# Altium schematic sheet Top.SchDoc
size B
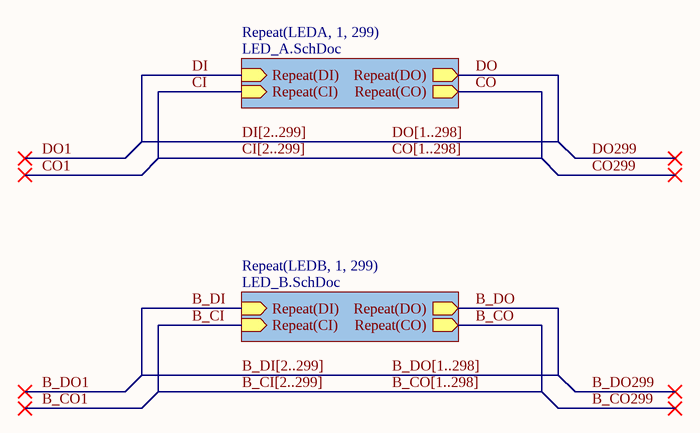
[diagram p0: Top.SchDoc]

## Sub-sheets
Repeat(LEDA, 1, 299) = LED_A.SchDoc: Repeat(DI) (in), Repeat(CI) (in), Repeat(CO) (out), Repeat(DO) (out)
Repeat(LEDB, 1, 299) = LED_B.SchDoc: Repeat(DI) (in), Repeat(CI) (in), Repeat(CO) (out), Repeat(DO) (out)

## Nets
B_CI: sheet Repeat(LEDB, 1, 299)/Repeat(CI)
B_CO: sheet Repeat(LEDB, 1, 299)/Repeat(CO)
B_DI: sheet Repeat(LEDB, 1, 299)/Repeat(DI)
B_DO: sheet Repeat(LEDB, 1, 299)/Repeat(DO)
CI: sheet Repeat(LEDA, 1, 299)/Repeat(CI)
CO: sheet Repeat(LEDA, 1, 299)/Repeat(CO)
DI: sheet Repeat(LEDA, 1, 299)/Repeat(DI)
DO: sheet Repeat(LEDA, 1, 299)/Repeat(DO)

## Buses and harness runs
bus B_CI[2..299] = B_CO[1..298]
bus B_DI[2..299] = B_DO[1..298]
bus CI[2..299] = CO[1..298]
bus DI[2..299] = DO[1..298]